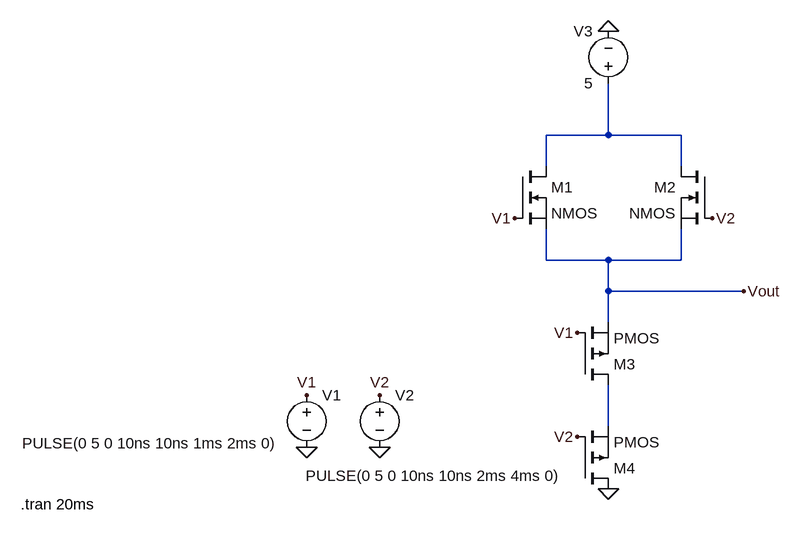
[diagram p0: schematic ou.asc]
ou.asc, the LTspice schematic file:
Version 4
SHEET 1 880 680
WIRE 464 -192 464 -272
WIRE 464 -192 368 -192
WIRE 576 -192 464 -192
WIRE 368 -144 368 -192
WIRE 576 -144 576 -192
WIRE 368 0 368 -48
WIRE 464 0 368 0
WIRE 576 0 576 -48
WIRE 576 0 464 0
WIRE 464 48 464 0
WIRE 672 48 464 48
WIRE 464 96 464 48
WIRE 464 256 464 192
FLAG 0 288 0
FLAG 112 288 0
FLAG 464 352 0
FLAG 464 -352 0
FLAG 0 208 V1
FLAG 112 208 V2
FLAG 320 -64 V1
FLAG 416 112 V1
FLAG 624 -64 V2
FLAG 416 272 V2
FLAG 672 48 Vout
SYMBOL voltage 0 192 R0
WINDOW 3 -438 90 Left 2
WINDOW 123 0 0 Left 0
WINDOW 39 0 0 Left 0
SYMATTR InstName V1
SYMATTR Value PULSE(0 5 0 10ns 10ns 1ms 2ms 0)
SYMBOL voltage 112 192 R0
WINDOW 3 -114 140 Left 2
WINDOW 123 0 0 Left 0
WINDOW 39 0 0 Left 0
SYMATTR InstName V2
SYMATTR Value PULSE(0 5 0 10ns 10ns 2ms 4ms 0)
SYMBOL nmos 320 -144 R0
SYMATTR InstName M1
SYMBOL nmos 624 -144 M0
SYMATTR InstName M2
SYMBOL pmos 416 192 M180
SYMATTR InstName M3
SYMBOL pmos 416 352 M180
SYMATTR InstName M4
SYMBOL voltage 464 -256 R180
WINDOW 0 24 96 Left 2
WINDOW 3 24 16 Left 2
WINDOW 123 0 0 Left 0
WINDOW 39 0 0 Left 0
SYMATTR InstName V3
SYMATTR Value 5
TEXT -440 376 Left 2 !.tran 20ms

The netlist it stands for:
* ou.asc
V1 V1 0 PULSE(0 5 0 10ns 10ns 1ms 2ms 0)
V2 V2 0 PULSE(0 5 0 10ns 10ns 2ms 4ms 0)
M1 N001 V1 Vout Vout NMOS
M2 N001 V2 Vout Vout NMOS
M3 N002 V1 Vout Vout PMOS
M4 0 V2 N002 N002 PMOS
V3 N001 0 5
.model NMOS NMOS
.model PMOS PMOS
.lib standard.mos
.tran 20ms
.backanno
.end